# EAGLE design EskonzoUSB_base (EAGLE 9.4.2)
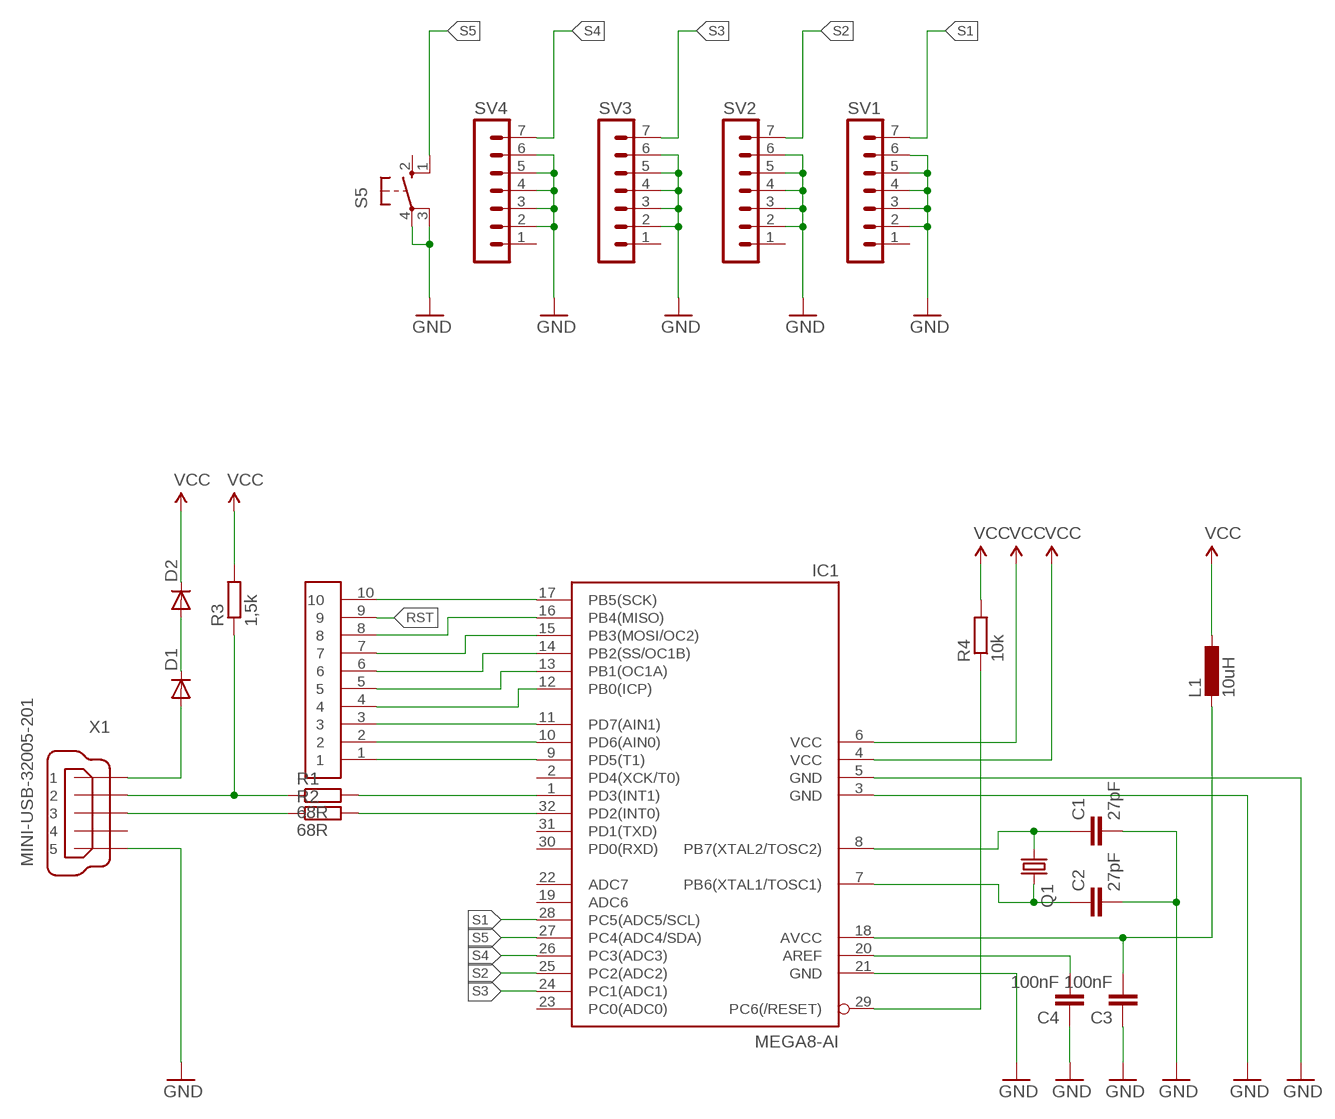
[diagram p0: schematic, sheet 1]

## Parts
C1  27pF  C-EUC0805  [C0805]
C2  27pF  C-EUC0805  [C0805]
C3  100nF  C-EUC0805  [C0805]
C4  100nF  C-EUC0805  [C0805]
D1  DIODE-MELF-MLL41  [MELF-MLL41]
D2  DIODE-MELF-MLL41  [MELF-MLL41]
IC1  MEGA8-AI  [TQFP32-08]
L1  10uH  L-EUL1812  [L1812]
Q1  CRYSTALHC49UP  [HC49UP]
R1  68R  R-EU_R0805  [R0805]
R2  68R  R-EU_R0805  [R0805]
R3  1,5k  R-EU_R0805  [R0805]
R4  10k  R-EU_R0805  [R0805]
S5  40-XX_SMD  [B3F-40XX_SMD]
SV1  MA07-1_SMD  [MA07-1_SMD]
SV2  MA07-1_SMD  [MA07-1_SMD]
SV3  MA07-1_SMD  [MA07-1_SMD]
SV4  MA07-1_SMD  [MA07-1_SMD]
U$1  PINY_1X9_1.27MM_SMT  [PINY_1X9_1.27MM_SMT]
X1  MINI-USB-32005-201  [32005-201]

## Nets
GND: C1.2 C2.2 C3.1 C4.1 IC1.3(GND) IC1.5(GND) IC1.21(GND) S5.3(P1) S5.4(P) SV1.2 SV1.3 SV1.4 SV1.5 SV1.6 SV2.2 SV2.3 SV2.4 SV2.5 SV2.6 SV3.2 SV3.3 SV3.4 SV3.5 SV3.6 SV4.2 SV4.3 SV4.4 SV4.5 SV4.6 X1.5
N$1: R1.1 R3.1 X1.2
N$2: R2.1 X1.3
N$3: IC1.1(PD3(INT1)) R1.2
N$4: IC1.32(PD2(INT0)) R2.2
N$5: D1.A X1.1
N$6: D1.C D2.A
N$7: C1.1 IC1.8(PB7(XTAL2/TOSC2)) Q1.1
N$8: C2.1 IC1.7(PB6(XTAL1/TOSC1)) Q1.2
N$10: C3.2 IC1.18(AVCC) L1.2
N$11: IC1.17(PB5(SCK)) U$1.10
N$12: C4.2 IC1.20(AREF)
N$13: IC1.15(PB3(MOSI/OC2)) U$1.7
N$14: IC1.16(PB4(MISO)) U$1.8
N$15: IC1.14(PB2(SS/OC1B)) U$1.6
N$16: IC1.13(PB1(OC1A)) U$1.5
N$17: IC1.12(PB0(ICP)) U$1.4
N$18: IC1.11(PD7(AIN1)) U$1.3
N$19: IC1.10(PD6(AIN0)) U$1.2
N$20: IC1.9(PD5(T1)) U$1.1
RST: IC1.29(PC6(/RESET)) R4.1 U$1.9
S1: IC1.28(PC5(ADC5/SCL)) SV1.7
S2: IC1.25(PC2(ADC2)) SV2.7
S3: IC1.24(PC1(ADC1)) SV3.7
S4: IC1.26(PC3(ADC3)) SV4.7
S5: IC1.27(PC4(ADC4/SDA)) S5.1(S1)
VCC: D2.C IC1.4(VCC) IC1.6(VCC) L1.1 R3.2 R4.2
Unconnected: IC1.2(PD4(XCK/T0)) IC1.19(ADC6) IC1.22(ADC7) IC1.23(PC0(ADC0)) IC1.30(PD0(RXD)) IC1.31(PD1(TXD)) S5.2(S) SV1.1 SV2.1 SV3.1 SV4.1 X1.4

## Library data of the parts
C1-C4 = rcl:C-EU: CAPACITOR, European symbol
D1 D2 = diode:DIODE-: DIODE
IC1 = atmel:MEGA8: MICROCONTROLLER 8 Kbytes FLASH, 1 kbytes SRAM, 512 bytes EEPROM, USART, 6-channel 10 bit ADC, 2-channel 8 bit ADC Pin compatible with Atmega48, ATMega88, ATMega168 Source: avr.lbr; MPN: ATMEGA8-16AU; OC_FARNELL: 9171371; OC_NEWARK: 73M8863
L1 = rcl:L-EU: INDUCTOR, European symbol
Q1 = crystal:CRYSTAL: CRYSTAL; OC_FARNELL: unknown; OC_NEWARK: unknown
R1-R4 = rcl:R-EU_: RESISTOR, European symbol
S5 = switch-omron:40-XX_SMD: OMRON SWITCH
SV1-SV4 = con-lstb:MA07-1_SMD
U$1 = goldpin_custom_smd:PINY_1X9_1.27MM_SMT
X1 = con-cypressindustries:MINI-USB-: MINI USB-B Conector Source: www.cypressindustries.com; OC_FARNELL: unknown; OC_NEWARK: unknown

## Board
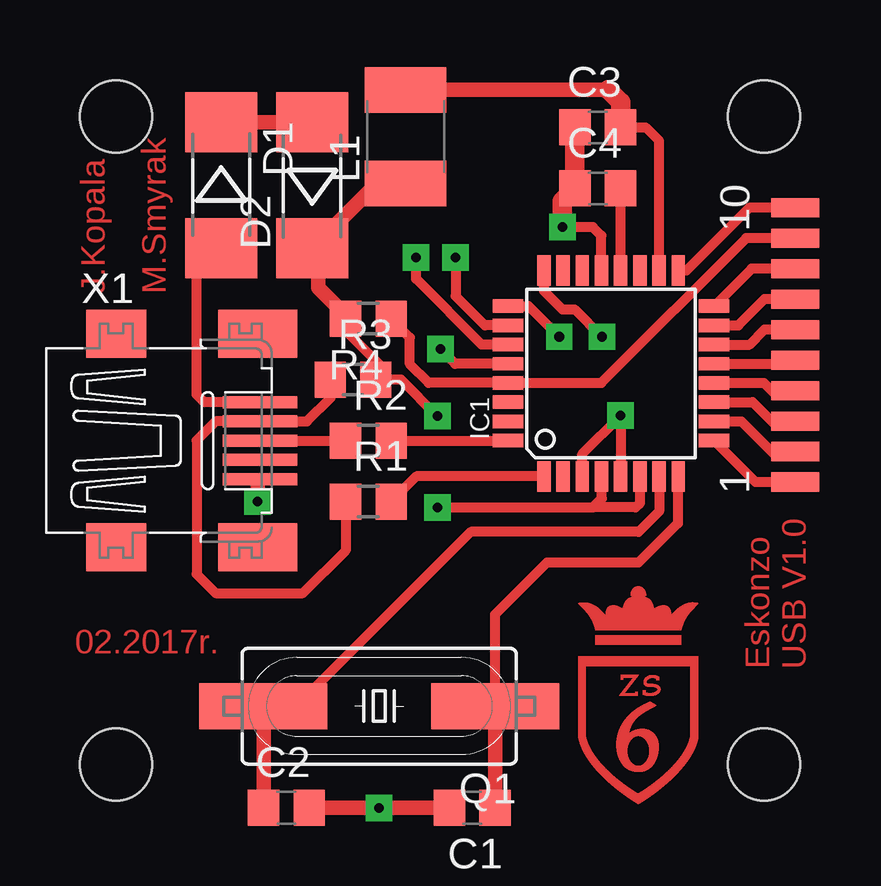
[diagram p1: board, top side]
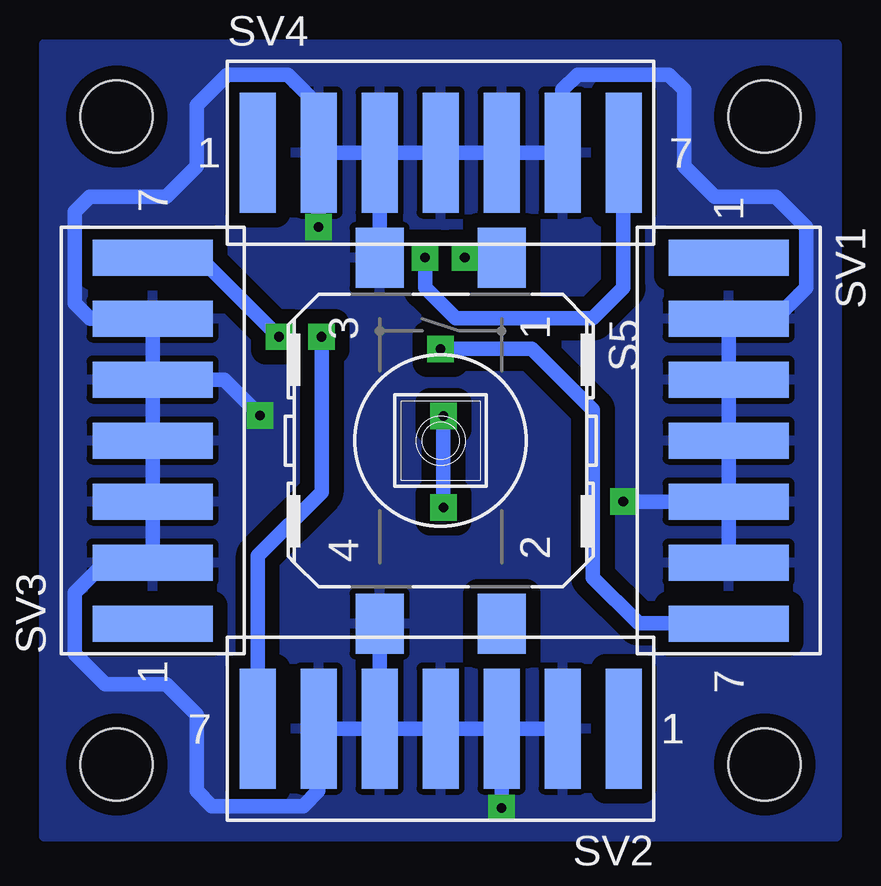
[diagram p2: board, bottom side, seen from below]

No outline drawn. Coordinates in mm, seen from the top.
Copper layers (1*16): Top 0.035mm / dielectric 1.5mm / Bottom 0.035mm
Design rules "default *": minimum track width 0.4mm, minimum drill 0.4mm, track to track 0.2mm, track to pad 0.2mm, pad to pad 0.2mm, via to via 0.2mm, smd to smd 0mil, copper to edge 0.4mm, drill to drill 8mil, minimum pad ring 10mil, minimum via ring 8mil, stop-mask expansion 4mil, vias tented up to drill 0mil, thermal gap 10mil
Holes 3 mm at 3,3 30,3 30,30 3,30

### Footprints (pad centres in the part's own frame; a part is rotated, then mirrored left to right if it is on the bottom)
C0805 = smd 1.3 x 1.5: 1 -0.95,0; 2 0.95,0
MELF-MLL41 = smd 2.5 x 3: A 2.625,0; C -2.625,0
TQFP32-08 = smd 1.27 x 0.559: 1 -4.293,2.8; 2 -4.293,2; 3 -4.293,1.2; 4 -4.293,0.4; 5 -4.293,-0.4; 6 -4.293,-1.2; 7 -4.293,-2; 8 -4.293,-2.8; 17 4.293,-2.8; 18 4.293,-2; 19 4.293,-1.2; 20 4.293,-0.4; 21 4.293,0.4; 22 4.293,1.2; 23 4.293,2; 24 4.293,2.8 | smd 0.559 x 1.27: 9 -2.8,-4.293; 10 -2,-4.293; 11 -1.2,-4.293; 12 -0.4,-4.293; 13 0.4,-4.293; 14 1.2,-4.293; 15 2,-4.293; 16 2.8,-4.293; 25 2.8,4.293; 26 2,4.293; 27 1.2,4.293; 28 0.4,4.293; 29 -0.4,4.293; 30 -1.2,4.293; 31 -2,4.293; 32 -2.8,4.293
L1812 = smd 1.9 x 3.4: 1 -1.95,0; 2 1.95,0
HC49UP = smd 5.334 x 1.93: 1 -4.826,0; 2 4.826,0
R0805 = smd 1.3 x 1.5: 1 -0.95,0; 2 0.95,0
B3F-40XX_SMD = smd 2.5 x 2: 1 -7.62,2.54; 2 7.62,2.54; 3 -7.62,-2.54; 4 7.62,-2.54
MA07-1_SMD = smd 1.5 x 5: 1 -7.62,0; 2 -5.08,0; 3 -2.54,0; 4 0,0; 5 2.54,0; 6 5.08,0; 7 7.62,0
PINY_1X9_1.27MM_SMT = smd 0.8 x 2: 1 -5.08,0; 2 -3.81,0; 3 -2.54,0; 4 -1.27,0; 5 0,0; 6 1.27,0; 7 2.54,0; 8 3.81,0; 9 5.08,0; 10 6.35,0
32005-201 = smd 3.1 x 0.5: 1 3,1.6; 2 3,0.8; 3 3,0; 4 3,-0.8; 5 3,-1.6 | smd 2.5 x 2: M1 -3,-4.45; M2 -3,4.45 | smd 3.3 x 2: M3 2.9,4.45; M4 2.9,-4.45

### Placement (x,y rotation side)
C1  17.84,1.2 180 top
C2  10.09,1.2 0 top
C3  23.06,29.55 0 top
C4  23.06,27.01 0 top
D1  7.38,27.13 270 top
D2  11.17,27.13 90 top
IC1  23.62,19.3 90 top
L1  15.06,29.16 90 top
Q1  13.96,5.44 180 top
R1  13.51,13.96 0 top
R2  13.51,16.5 0 top
R3  12.87,19.04 0 top
R4  13.51,21.58 180 top
S5  16.5,16.5 270 bottom
SV1  4.5,16.5 270 bottom
SV2  16.5,4.5 180 bottom
SV3  28.5,16.5 90 bottom
SV4  16.5,28.5 0 bottom
U$1  31.31,19.85 90 top
X1  6,16.5 0 top

### Tracks (layer width: path | path; a pad name or v marks a point on that pad's centre or on a via)
GND  (via drill 0.4 pad 1.1)
  Top 0.406: 8.89,14.79 X1.5 | IC1.21 23.22,25.04 22.86,25.4 v21.59,25.4 | IC1.5 v24.02,17.55 22.42,15.95 IC1.3
  Top 0.61: v8.89,13.97 8.89,14.79 | C2.2 v13.96,1.2 C1.2
  Top 0.813: C3.1 C4.1 21.59,26.48 v21.59,25.4
  Bottom 0.406: S5.4 19.04,8.27
  Bottom 0.61: SV2.5 SV2.4 SV2.3 SV2.2 SV2.3 13.97,2.54 13.96,2.54 v13.96,1.2 | SV2.5 SV2.6 | SV1.6 SV1.5 | SV1.5 SV1.4 SV1.3 SV1.2 2.55,21.58 1.27,22.86 1.27,25.4 2.54,26.67 5.08,26.67 6.35,27.94 6.35,31.11 6.99,31.75 10.79,31.75 11.43,31.11 SV4.6 SV4.5 SV4.4 SV4.3 | SV4.3 SV4.2 v21.58,25.41 v21.59,25.4 | SV2.6 21.01,4.5 | SV2.5 | SV1.5 v8.88,13.96 v8.89,13.97 | S5.3 SV4.3 | S5.4 SV2.5 | SV3.5 25.52,19.04 v24.02,17.55 | SV3.5 SV3.4 SV3.3 SV3.2 30.49,11.42 31.75,10.16 31.75,7.62 30.48,6.35 27.94,6.35 26.67,5.08 26.67,1.91 | SV3.5 SV3.6 31.11,21.58 31.75,22.23 31.75,26.04 31.11,26.67 27.94,26.67 26.67,27.94 26.67,30.48 25.4,31.75 22.86,31.75 21.59,30.48 v21.59,25.4 | SV2.6 21.59,1.91 22.23,1.27 26.04,1.27 26.67,1.91 | v21.59,25.4 | 26.67,1.91
  pour Bottom (isolate 0.61): 0,0 33.02,0 33.02,33.02 0,33.02
N$1
  Top 0.406: R1.1 12.56,11.92 10.79,10.15 7.14,10.15 6.35,10.94 6.35,16.51 7.14,17.3 X1.2 10.95,17.3 11.92,18.27 R3.1
N$2
  Top 0.406: X1.3 R2.1
N$3
  Top 0.406: IC1.1 15.51,15.01 R1.2
N$4
  Top 0.406: R2.2 IC1.32
N$5
  Top 0.406: X1.1 6.67,18.1 6.35,18.41 6.35,24.5 D1.A
N$6
  Top 0.61: D1.C D2.A
N$7
  Top 0.406: IC1.8 26.41,14.99 26.41,13.05 26.39,13.05 24.77,11.43 20.95,11.43 18.79,9.26 Q1.1
  Top 0.61: C1.1 | C1.1 Q1.1
N$8
  Top 0.406: IC1.7 25.62,13.56 24.77,12.7 17.78,12.7 10.16,5.08 9.49,5.08 Q1.2
  Top 0.61: Q1.2 C2.1
N$10
  Top 0.406: C3.2 25.06,29.55 25.62,28.99 IC1.18
  Top 0.61: 23.5,31.11 L1.2
  Top 0.813: C3.2 24.02,30.6 23.5,31.11 | 14.05,31.11 L1.2
N$11
  Top 0.406: IC1.17 26.77,23.59 29.38,26.2 U$1.10
N$12
  Top 0.406: IC1.20 24.02,27 C4.2
N$13
  Top 0.406: IC1.15 28.92,21.3 30.01,22.39 U$1.7
N$14
  Top 0.406: U$1.8 29.48,23.66 IC1.16
N$15
  Top 0.406: IC1.14 29.39,20.5 30.01,21.12 U$1.6
N$16
  Top 0.406: IC1.13 31.15,19.7 U$1.5
N$17
  Top 0.406: IC1.12 29.99,18.9 30.48,18.41 31.14,18.41 U$1.4
N$18
  Top 0.406: IC1.11 29.52,18.1 30.48,17.14 31.14,17.14 U$1.3
N$19
  Top 0.406: IC1.10 29.05,17.3 30.48,15.88 31.14,15.88 U$1.2
N$20
  Top 0.406: 27.92,16.51 IC1.9 29.64,14.77 U$1.1
RST
  Top 0.406: 14.46,21.1 R4.1 15.24,20.8 15.24,19.68 16.02,18.9 IC1.29 23.22,18.9 29.25,24.93 U$1.9
S1  (via drill 0.4 pad 1.1)
  Top 0.406: IC1.28 17.13,19.7 v16.51,20.32
  Bottom 0.61: v16.51,20.32 12.7,20.32 10.16,17.78 10.16,10.79 8.26,8.89 SV1.7
S2  (via drill 0.4 pad 1.1)
  Top 0.406: IC1.25 20.19,22.1 v21.46,20.83
  Bottom 0.61: SV2.7 24.12,11.69 21.46,14.35 v21.46,20.83
S3  (via drill 0.4 pad 1.1)
  Top 0.406: IC1.24 20.82,22.74 21.59,21.97 22.1,21.97 v23.24,20.83
  Bottom 0.61: SV3.7 26.53,24.12 v23.24,20.83
S4  (via drill 0.4 pad 1.1)
  Top 0.406: IC1.26 18.36,21.3 17.14,22.52 v17.14,24.13
  Bottom 0.61: v17.14,24.13 17.14,22.86 15.88,21.59 10.16,21.59 8.89,22.86 SV4.7
S5  (via drill 0.4 pad 1.1)
  Top 0.406: IC1.27 18.23,20.5 15.49,23.24 v15.49,24.13
  Bottom 0.61: v15.49,24.13 S5.1
VCC  (via drill 0.4 pad 1.1)
  Top 0.406: 12.56,21.25 R4.2 12.7,21.44 12.7,20.95 14.24,19.42 | 14.24,19.57 14.24,19.42 | 14.24,19.26 R3.2 | 14.24,19.26 14.24,19.42 | 14.24,19.26 14.05,19.26 13.84,19.05 14.86,19.05 v16.38,17.53 | v16.38,13.72 22.86,13.72 | 22.86,13.72 23.24,14.1 23.24,14.99 IC1.4 | IC1.6 24.82,13.9 24.64,13.72 22.86,13.72
  Top 0.61: R4.2 12.56,21.73 11.43,22.86 11.43,24.25 D2.C 13.87,27.21 L1.1
  Bottom 0.61: v16.38,17.53 v16.38,13.72
(copper drawn outside any net)
  shapes: Top area x8623

### Text on the board
Top: J.Kopala | M.Smyrak | 02.2017r. | Eskonzo / USB V1.0